# EAGLE design blink_smt (EAGLE 4.16)
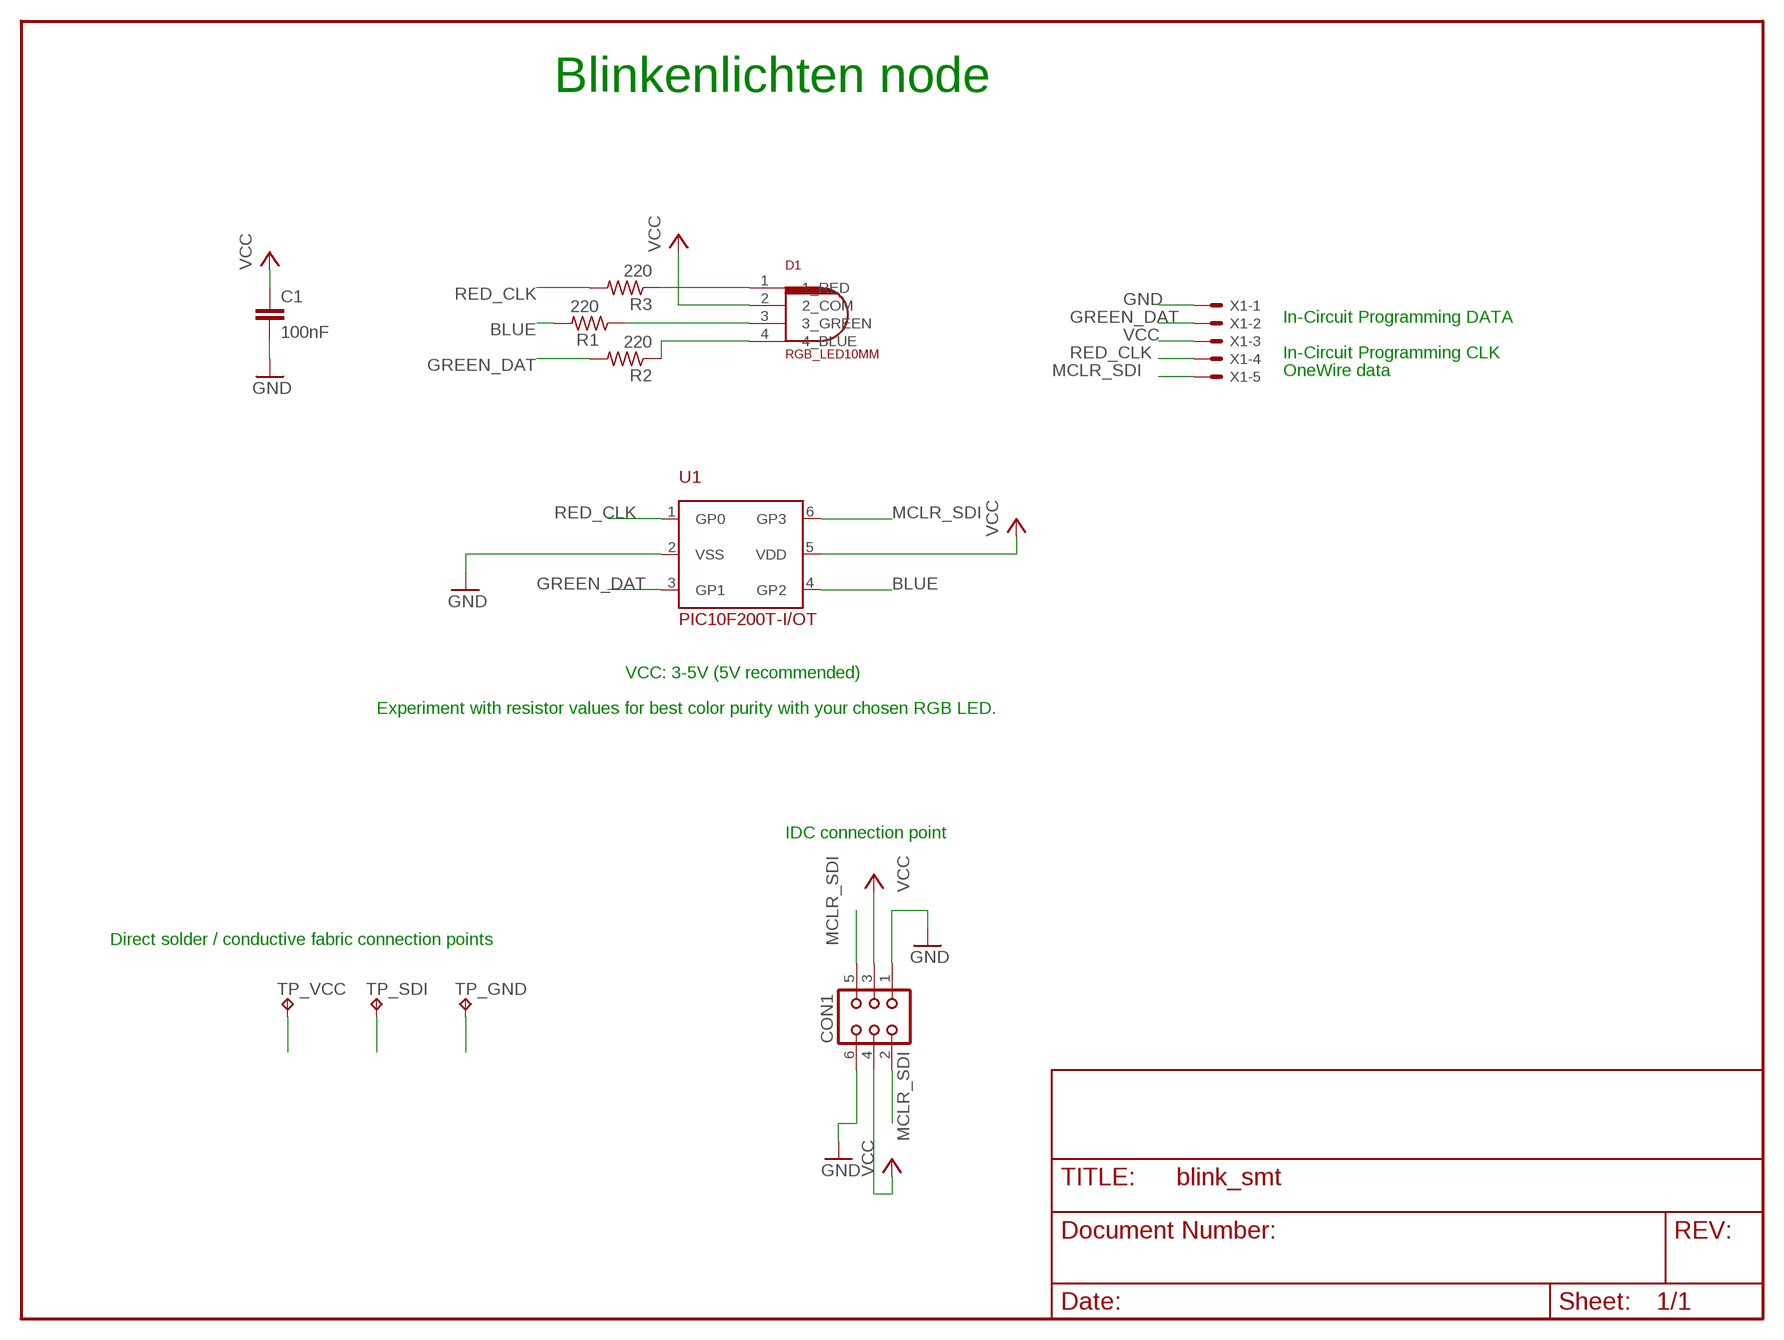
[diagram p0: schematic, sheet 1]

## Parts
C1  100nF  C-EUC0603K  [C0603K]
CON1  CON06  [CON06]
D1  RGB_LED10MM  [LED_RGB_10MM]
R1  220  R-US_R0603  [R0603]
R2  220  R-US_R0603  [R0603]
R3  220  R-US_R0603  [R0603]
TP_GND  TPPAD1-13  [P1-13]
TP_SDI  TPPAD1-13  [P1-13]
TP_VCC  TPPAD1-13  [P1-13]
U1  PIC10F200T-I/OT  PIC10F20XI/OT  [SOT23-6]
X1  53047-05  [53047-05]

## Nets
BLUE: R1.2 U1.4(GP2)
GND [bus]: C1.2 CON1.1 CON1.6 TP_GND.1(TP) U1.2(VSS) X1.1
GREEN_DAT: R2.2 U1.3(GP1) X1.2
MCLR_SDI [bus]: CON1.2 CON1.5 TP_SDI.1(TP) U1.6(GP3) X1.5
N$1: D1.1(1_RED) R3.1
N$2: D1.3(3_GREEN) R1.1
N$3: D1.4(4_BLUE) R2.1
RED_CLK: R3.2 U1.1(GP0) X1.4
VCC [bus]: C1.1 CON1.3 CON1.4 D1.2(2_COM) TP_VCC.1(TP) U1.5(VDD) X1.3

## Notes on the sheet
- Blinkenlichten node
- In-Circuit Programming DATA
- In-Circuit Programming CLK
- OneWire data
- VCC: 3-5V (5V recommended)
- Experiment with resistor values for best color purity with your chosen RGB LED.
- IDC connection point
- Direct solder / conductive fabric connection points

## Library data of the parts
C1 = rcl:C-EU: CAPACITOR, European symbol
CON1 = con-harting:CON06: CONNECTOR
D1 = tim:RGB_LED
R1-R3 = rcl:R-US_: RESISTOR, American symbol
TP_GND TP_SDI TP_VCC = testpad:TP
U1 = mideeval:PIC10F20X: PIC10F20X microcontroller in SOT-6. 20051104 / tgipson
X1 = con-molex:53?-05: CONNECTOR wire to board 1.25 mm (.049 inch) pitch header

## Net classes
0 default: width 0.203 mm, drill 0.178 mm, clearance 0.381 mm
1 bus: width 0.178 mm, drill 0.178 mm, clearance 0.381 mm

## Board
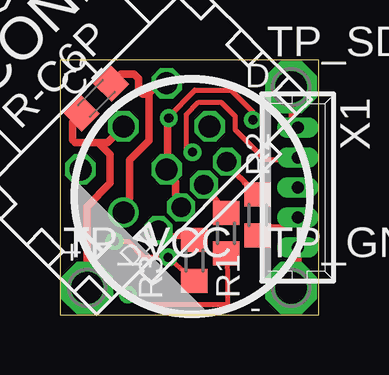
[diagram p1: board, top side]
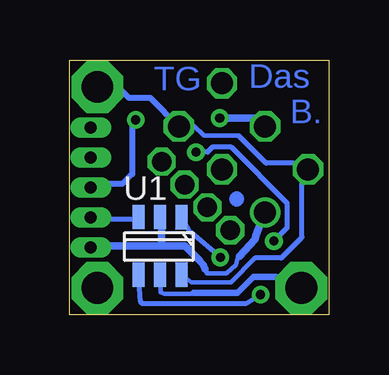
[diagram p2: board, bottom side, seen from below]

Size 10.8 x 10.64 mm. Coordinates in mm from the lower left corner, seen from the top.
Outline: 0,0 10.8,0 10.8,10.64 0,10.64 0,0
Copper layers (1*16): Top 0.035mm / dielectric 1.5mm / Bottom 0.035mm
Design rules "default": minimum track width 7mil, minimum drill 15mil, track to track 7mil, track to pad 7mil, pad to pad 7mil, via to via 7mil, smd to smd 7mil, copper to edge 40mil, drill to drill 8mil, minimum pad ring 7mil, minimum via ring 7mil, stop-mask expansion 4mil, vias tented up to drill 0mil, thermal gap 10mil

### Footprints (pad centres in the part's own frame; a part is rotated, then mirrored left to right if it is on the bottom)
C0603K = smd 1.05 x 1.08: 1 -0.875,0; 2 0.875,0
CON06 = drill 0.914 round: 1 -2.54,-1.27 | drill 0.914 octagon: 2 -2.54,1.27; 3 0,-1.27; 4 0,1.27; 5 2.54,-1.27; 6 2.54,1.27
LED_RGB_10MM = drill 0.813 pad 1.016 octagon: 1 1.981,0; 2 0.635,0; 3 -0.711,0; 4 -2.057,0
R0603 = smd 1 x 1.1: 1 -0.85,0; 2 0.85,0
P1-13 = drill 1.321 pad 2.159 octagon: 1 0,0
SOT23-6 = smd 0.508 x 1.016: 1 -0.9,-1.2; 2 0,-1.21; 3 0.9,-1.21; 4 0.9,1.2; 5 0,1.203; 6 -0.9,1.2
53047-05 = drill 0.5 pad 0.698 long: 1 2.5,0; 2 1.25,0; 3 0,0; 4 -1.25,0; 5 -2.5,0

### Placement (x,y rotation side)
C1  1.52,9.03 45 top
CON1  3.55,6.97 45 top
D1  5.51,4.94 225 top
R1  6.93,3.42 270 top
R2  8.25,4.18 270 top
R3  5.61,2.27 270 top
TP_GND  9.65,1.13 0 top
TP_SDI  9.65,9.51 0 top
TP_VCC  1.14,1.13 0 top
U1  7.03,2.88 180 bottom
X1  9.93,5.32 270 top

### Tracks (layer width: path | path; a pad name or v marks a point on that pad's centre or on a via)
BLUE  (via drill 0.38)
  Top 0.203: v2.84,0.85 3.48,0.44 7,0.44 7,1.82 R1.2
  Bottom 0.203: v2.84,0.85 3.45,0.47 7.77,0.47 7.84,0.55 U1.4
GND
  Top 0.178: 3.73,9.21 3.73,9.26 | 2.54,10.05 C1.2 | 4.46,9.72 4.46,9.68 CON1.6
  Top 0.305: X1.1 9.93,1.82 TP_GND.1 | CON1.1 2.92,4.89 2.92,6.46 3.73,7.28 3.73,9.21 3.45,9.21 3.27,9.39 3.27,9.87 3.09,10.05 2.54,10.05 | 3.73,9.26 4.19,9.72 4.46,9.72
  Bottom 0.178: 9.86,2.88 X1.1 | 5.15,1.92 5.08,1.74 4.26,1.74 3.86,2.1 3.81,2.35 3.73,2.45 | 6.98,3.97 U1.2
  Bottom 0.305: CON1.1 2.92,3.65 3.04,3.31 3.07,3.16 3.73,2.45 | 6.98,2.88 5.99,2.88 5.38,2.27 5.23,2.07 5.15,1.92 | 6.98,2.88 9.86,2.88 | 6.98,2.88 6.98,3.97
GREEN_DAT
  Top 0.203: 8.78,3.65 R2.2
  Top 0.254: 8.78,3.65 9.34,3.65 X1.2
  Bottom 0.203: X1.2 9.34,4 7.95,4 U1.3
MCLR_SDI
  Top 0.254: X1.5 9.65,7.99 TP_SDI.1
  Bottom 0.178: U1.6 5.71,1.36 4.08,1.36 3.07,2.38 | 3.75,7.48 5.2,7.48 5.63,7.91 CON1.5
  Bottom 0.203: 3.75,7.48 2.61,6.34 1.47,6.34 CON1.2 1.11,5.45 1.11,3.24 1.98,2.38 3.07,2.38
  Bottom 0.254: TP_SDI.1 8.78,9.51 8.33,9.06 7.44,9.06 CON1.5
N$1
  Top 0.203: 5.18,3.29 R3.1
  Top 0.254: 5.18,3.29 4.67,3.29 D1.1
N$2
  Top 0.254: R1.1 6.45,4.89 6.29,5.04 D1.3
N$3
  Top 0.254: R2.1 7.72,5.52 7.31,5.93 D1.4
RED_CLK  (via drill 0.38)
  Top 0.178: v4.52,2.4 5.18,1.82 R3.2
  Top 0.203: v5.53,6.79 5.28,6.9 5.28,8.37 5.79,8.88 6.73,8.88 7.31,8.29 7.31,7.73 8.55,6.49 9.34,6.49 X1.4 | v2.28,3.09 2.81,3.09 3.48,2.43 4.36,2.43 v4.52,2.4
  Bottom 0.203: v4.52,2.4 5.74,3.44 5.81,3.49 U1.1 | v5.53,6.79 5.05,6.79 4.85,7 4.06,7 1.72,4.66 1.72,3.65 v2.28,3.09
VCC  (via drill 0.38)
  Top 0.178: 4.54,8.27 4.49,8.01 v4.54,8.22 | 0.63,7.2 0.53,7.3
  Top 0.203: v8.05,8.14 8.05,8.47 7.13,9.39 5.63,9.39 4.54,8.27
  Top 0.305: 4.49,8.01 4.49,6.69 CON1.3 4.82,5.55 4.82,5.07 D1.2 | TP_VCC.1 1.14,4.53 2.1,5.5 2.1,6.69 1.6,7.2 | C1.1 0.53,8.04 0.53,7.3 | 1.6,7.2 0.63,7.2 | CON1.4 1.98,7.2 1.6,7.2
  Bottom 0.178: v8.05,8.14 8.05,8.06 | U1.5 7,0.95 6.85,0.88 5.74,0.88 5.63,0.93 | TP_VCC.1 1.16,1.11 1.16,1.38
  Bottom 0.254: 8.05,8.06 8.2,7.91 8.2,5.88 8.61,5.47 9.57,5.47 X1.3
  Bottom 0.279: 5.63,0.93 3.81,0.93 3.15,1.59 2.21,1.59 1.16,1.38
  Bottom 0.305: v4.54,8.22 2.79,8.22 CON1.4
(copper drawn outside any net)
  shapes: Bottom circle x1

### Text on the board
Bottom: Das | TG | B.
tNames: D | + | -